# Altium schematic sheet PP_Schematic.SchDoc
size A; SheetNumber: 1; SheetTotal: 1
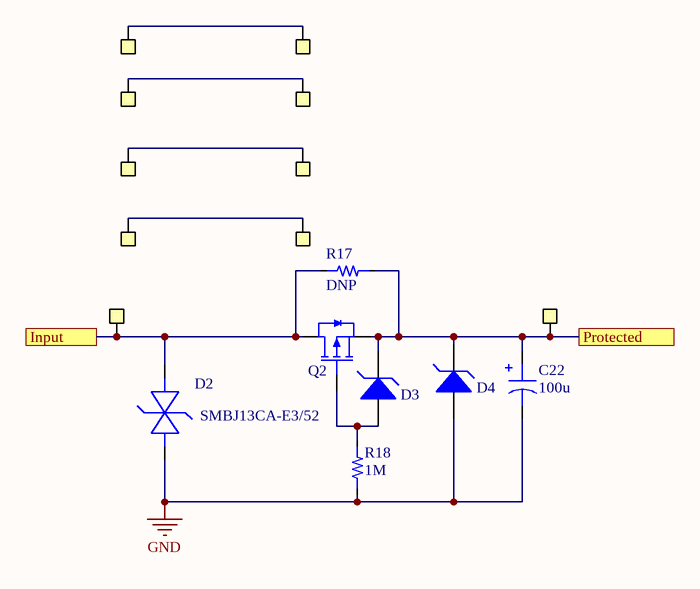
[diagram p0: PP_Schematic.SchDoc]

## Parts
C22  value 100u  [6.60x6.60x8.00mm_E_CAP]  (hidden comment: 865080343009)
D2  SMBJ13CA-E3/52  [SMBJ13CA-E3/52]
D3  MMSZ5231B-7-F  [SOD-123]  (value not drawn)
D4  MMSZ5231B-7-F  [SOD-123]  (value not drawn)
Q2  MOSFET P-CH 30V 2A SOT-23  [SOT23-3]  (value not drawn)
R17  value DNP  [0603_RES]  (hidden comment: Resistor)
R18  value 1M  [0603_RES]  (hidden comment: Resistor)
X1  GenericPinHeader(0.1in)  [GenericPinHeader(.1in)]  (value not drawn)
X2  GenericPinHeader(0.1in)  [GenericPinHeader(.1in)]  (value not drawn)
X3  GenericPinHeader(0.1in)  [GenericPinHeader(.1in)]  (value not drawn)
X4  GenericPinHeader(0.1in)  [GenericPinHeader(.1in)]  (value not drawn)
X5  GenericPinHeader(0.1in)  [GenericPinHeader(.1in)]  (value not drawn)
X6  GenericPinHeader(0.1in)  [GenericPinHeader(.1in)]  (value not drawn)
X7  GenericPinHeader(0.1in)  [GenericPinHeader(.1in)]  (value not drawn)
X8  GenericPinHeader(0.1in)  [GenericPinHeader(.1in)]  (value not drawn)
X9  GenericPinHeader(0.1in)  [GenericPinHeader(.1in)]  (value not drawn)
X10  GenericPinHeader(0.1in)  [GenericPinHeader(.1in)]  (value not drawn)

## Ports
Input, Protected

## Nets
GND: C22.2 D2.1 D4.2(A) R18.1
Input: D2.2 Q2.3(D) R17.1 X1.1(Pin) ; port Input
Protected: C22.1 D3.1(K) D4.1(K) Q2.2(S) R17.2 X2.1(Pin) ; port Protected
NetD3_2: D3.2(A) Q2.1(G) R18.2
NetX3_1: X3.1(Pin) X4.1(Pin)
NetX5_1: X5.1(Pin) X6.1(Pin)
NetX7_1: X7.1(Pin) X8.1(Pin)
NetX9_1: X9.1(Pin) X10.1(Pin)

## Library data of the parts
C22 = 865080343009: CAP ALUM 100UF 20% 16V SMD; Percent Tolerance: 20; Dielectric: *; ESR: *; ComponentLink1Description: Digikey; ComponentLink1URL: https://www.digikey.com/en/products/detail/w%C3%BCrth-elektronik/865080343009/5728014
D2 = SMBJ13CA-E3/52: 21.5V Clamp 27.9A Ipp Tvs Diode Surface Mount DO-214AA (SMBJ). Bidirectional; Vr: 13V; ComponentLink1Description: Digikey; ComponentLink1URL: https://www.digikey.com/en/products/detail/vishay-general-semiconductor-diodes-division/SMBJ13CA-E3-52/1119222?s=N4IgTCBcDaIMoFkBCApAjAZgMIEEC0AohgPQCsEAugL5A; Package: DO-214AA
D3 D4 = MMSZ5231B-7-F: Zener Diode 5.1V 500mW ±5% Surface Mount SOD-123; Num_Circuits: 1; Package: SOD-123; ComponentLink1Description: Digikey; ComponentLink1URL: https://www.digikey.com/en/products/detail/diodes-incorporated/MMSZ5231B-7-F/755472
Q2 = STR2P3LLH6: P-Channel 2A (Ta) 350mW (Tc) Surface Mount SOT-23; Type: P Channel; VdsMax: 30; Num_Circuits: 1; Current: 2; RdsOn: 56; Vt: 10; VgsMax: 20; Package: SOT-23; ComponentLink1Description: Digikey; ComponentLink1URL: https://www.digikey.com/en/products/detail/stmicroelectronics/STR2P3LLH6/5244876; ComponentLink2Description: Datasheet; ComponentLink2URL: https://www.st.com/content/ccc/resource/technical/document/datasheet/96/4a/55/9d/3c/16/47/d6/DM00084050.pdf/files/DM00084050.pdf/jcr:content/translations/en.DM00084050.pdf
X1-X10 = GenericPinHeader(0.1in): Generic .1in(2.54mm) pitch pin header
R17 R18 = Resistor: Tolerance: *